# Altium schematic sheet connector.SchDoc
size A4
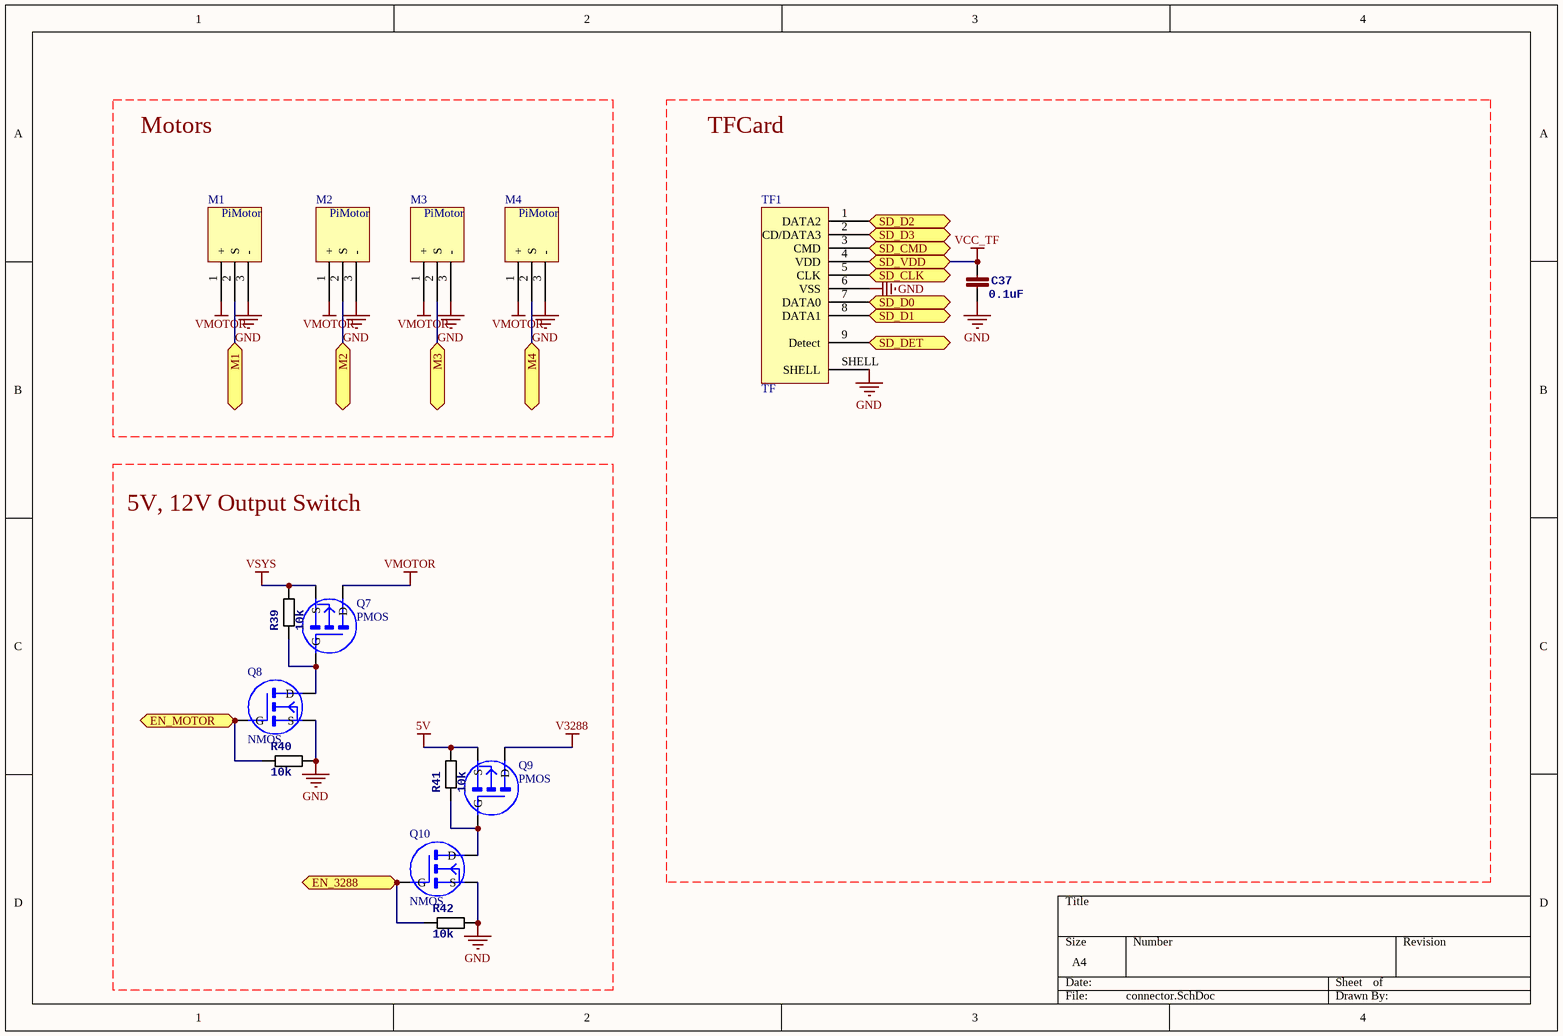
[diagram p0: connector.SchDoc]

## Parts
C37  0.1uF  [0402]
M1  PiMotor  [PiMotor]
M2  PiMotor  [PiMotor]
M3  PiMotor  [PiMotor]
M4  PiMotor  [PiMotor]
Q7  PMOS  [MOS_DFN5x6]
Q8  NMOS  [SOT23_L]
Q9  PMOS  [MOS_DFN3x3]
Q10  NMOS  [SOT23_L]
R39  10k  [0402]
R40  10k  [0402]
R41  10k  [0402]
R42  10k  [0402]
TF1  TF  [TF]

## Ports
EN_3288, EN_MOTOR, M1, M2, M3, M4, SD_CLK, SD_CMD, SD_D0, SD_D1, SD_D2, SD_D3, SD_DET, SD_VDD

## Nets
5V: Q9.S R41.2
GND: C37.1 M1.3(-) M2.3(-) M3.3(-) M4.3(-) Q8.S Q10.S R40.2 R42.2 TF1.6(VSS) TF1.SHELL
V3288: Q9.D
VCC_TF: C37.2 TF1.4(VDD) ; port SD_VDD
VMOTOR: M1.1(+) M2.1(+) M3.1(+) M4.1(+) Q7.D
VSYS: Q7.S R39.2
EN_3288: Q10.G R42.1 ; port EN_3288
EN_MOTOR: Q8.G R40.1 ; port EN_MOTOR
M1: M1.2(S) ; port M1
M2: M2.2(S) ; port M2
M3: M3.2(S) ; port M3
M4: M4.2(S) ; port M4
SD_CLK: TF1.5(CLK) ; port SD_CLK
SD_CMD: TF1.3(CMD) ; port SD_CMD
SD_D0: TF1.7(DATA0) ; port SD_D0
SD_D1: TF1.8(DATA1) ; port SD_D1
SD_D2: TF1.1(DATA2) ; port SD_D2
SD_D3: TF1.2(CD/DATA3) ; port SD_D3
SD_DET: TF1.9(Detect) ; port SD_DET
NetQ7_G: Q7.G Q8.D R39.1
NetQ9_G: Q9.G Q10.D R41.1

## Notes on the sheet
- Motors
- TFCard
- 5V, 12V Output Switch

## Library data of the parts
C37 = CAP0402-CAP: <b>Capacitor</b> / Standard 0603 ceramic capacitor, and 0.1" leaded capacitor.; PARTNO: CC0402ZRY5V7BB104
Q8 Q10 = NMOS: pin to pad: D>1 G>3 S>2
R39-R42 = RESISTOR0603B: <b>Resistor</b> / Basic schematic elements and footprints for 0603, 1206, and PTH 1/10th watt (small) resistors.; PARTNO: RMCF0402FT453K